# EAGLE schematic Antenna Board v2 (EAGLE 9.6.2)
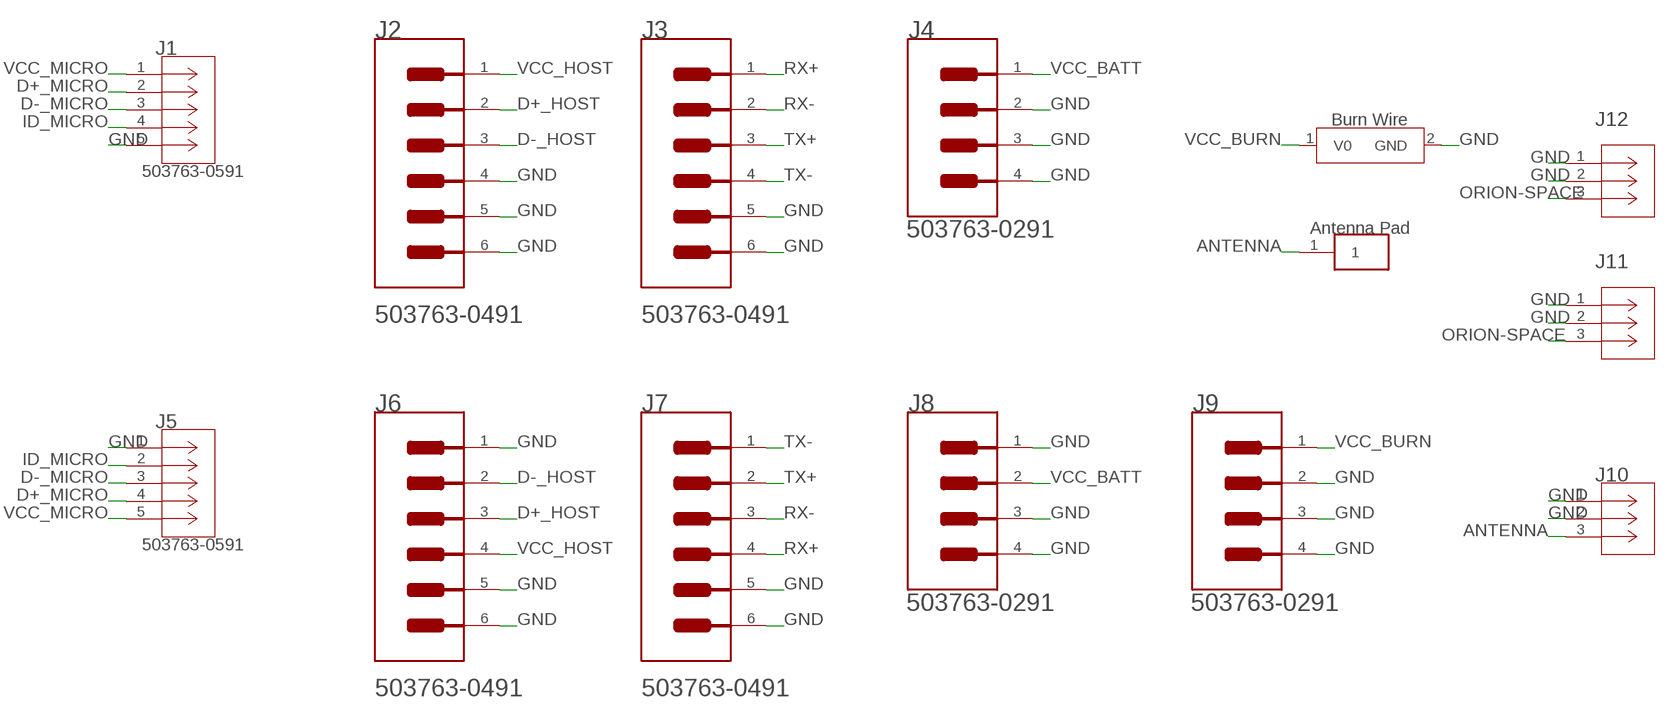
[diagram p0: schematic, sheet 1]

## Parts
J1  503763-0591  [CONN_5037630591_MOL]
J2  MOLEX_503763-0491MOLEX_503763-0491_0_0  [MOLEX_503763-0491_0]
J3  MOLEX_503763-0491MOLEX_503763-0491_0_0  [MOLEX_503763-0491_0]
J4  MOLEX_503763-0291MOLEX_503763-0291_0_0  [MOLEX_503763-0291_0]
J5  503763-0591  [CONN_5037630591_MOL]
J6  MOLEX_503763-0491MOLEX_503763-0491_0_0  [MOLEX_503763-0491_0]
J7  MOLEX_503763-0491MOLEX_503763-0491_0_0  [MOLEX_503763-0491_0]
J8  MOLEX_503763-0291MOLEX_503763-0291_0_0  [MOLEX_503763-0291_0]
J9  MOLEX_503763-0291MOLEX_503763-0291_0_0  [MOLEX_503763-0291_0]
J10  U.FL-R-SMT-1(01)  [CONN_-SMT-1(01)]
J11  U.FL-R-SMT-1(01)  [CONN_-SMT-1(01)]
J12  U.FL-R-SMT-1(01)  [CONN_-SMT-1(01)]
U$2  ANTENNA_PAD  [ANTENNA_PAD]
U$3  BURNWIRE  [BURNWIRE]

## Nets
ANTENNA: J10.3 U$2.1
D+_HOST: J2.2 J6.3
D+_MICRO: J1.2 J5.4
D-_HOST: J2.3 J6.2
D-_MICRO: J1.3 J5.3
GND: J1.5 J2.4 J2.5(MNT_1) J2.6(MNT_2) J3.5(MNT_1) J3.6(MNT_2) J4.2 J4.3(MNT_1) J4.4(MNT_2) J5.1 J6.1 J6.5(MNT_1) J6.6(MNT_2) J7.5(MNT_1) J7.6(MNT_2) J8.1 J8.3(MNT_1) J8.4(MNT_2) J9.2 J9.3(MNT_1) J9.4(MNT_2) J10.1 J10.2 J11.1 J11.2 J12.1 J12.2 U$3.2(GND)
ID_MICRO: J1.4 J5.2
ORION-SPACE: J11.3 J12.3
RX+: J3.1 J7.4
RX-: J3.2 J7.3
TX+: J3.3 J7.2
TX-: J3.4 J7.1
VCC_BATT: J4.1 J8.2
VCC_BURN: J9.1 U$3.1(V0)
VCC_HOST: J2.1 J6.4
VCC_MICRO: J1.1 J5.5

## Library data of the parts
J1 J5 = Molex - 503763-0591:503763-0591; BUILT_BY: EMA_Cory; COPYRIGHT: Copyright (C) 2018 Accelerated Designs. All rights reserved; DATASHEET: https://www.molex.com/pdm_docs/sd/5037630591_sd.pdf; MANUFACTURER_PART_NUMBER: 503763-0591; SOURCELIBRARY: Add_to_database_2020-12-14; VENDOR: Molex Connector Corporation
J2 J3 J6 J7 = Molex - 503763-0491:MOLEX_503763-0491: Wire-To-Board Connector, Pico-Lock 503763 Series, Surface Mount, Header, 4 Contacts, 1 mm; AUTOMOTIVE: No; CENTROID_NOT_SPECIFIED: No; CONN_GENDER: Male; CONN_ORIENTATION: Right Angle; CONTACT_MATERIAL: Gold,Nickel; CURRENT_RATING: 1.5A; DATASHEET: https://www.molex.com/webdocs/datasheets/pdf/en-us/5037630491_PCB_HEADERS.pdf; DEVICE_CLASS_L1: Connectors; DEVICE_CLASS_L2: Headers and Wire Housings; DEVICE_CLASS_L3: unset; DIGIKEY_DESCRIPTION: CONN HEADER 1MM R/A 4CKT; DIGIKEY_PART_NUMBER: WM10655CT-ND; FOOTPRINT_URL: https://www.molex.com/pdm_docs/sd/5037630491_sd.pdf; FOOTPRINT_VARIANT_NAME_0: Recommended_Land_Pattern; HEIGHT: 1.7mm; LEAD_FREE: Yes; MF: Molex; MFG_PACKAGE_IDENT: 503763-0491; MFG_PACKAGE_IDENT_DATE: 0; MFG_PACKAGE_IDENT_REV: 0; MOUSER_PART_NUMBER: 538-503763-0491; MPN: 503763-0491; NUMBER_OF_CONTACTS: 4; NUMBER_OF_ROWS: 1; PACKAGE: HDR4; PITCH: 1mm; PREFIX: J; ROHS: Yes; TEMPERATURE_RANGE_HIGH: +105°C; TEMPERATURE_RANGE_LOW: -40°C; VERIFICATION_VERSION: 0.0.0.1; VOLTAGE_RATING: 150V
J4 J8 J9 = Molex - 503763-0291:MOLEX_503763-0291: 2 Positions Header Connector 0.039" (1.00mm) Surface Mount, Right Angle Gold; CENTROID_NOT_SPECIFIED: No; DATASHEET: http://www.molex.com/pdm_docs/sd/5037630291_sd.pdf; DIGIKEY_DESCRIPTION: CONN HEADER 1MM R/A 2CKT; DIGIKEY_PART_NUMBER: WM10654CT-ND; LEAD_FREE: yes; MF: Molex; MOUSER_PART_NUMBER: 538-503763-0291; MPN: 503763-0291; PACKAGE: HDR02; PREFIX: J; ROHS: yes; TEMPERATURE_RANGE_HIGH: +105°C; TEMPERATURE_RANGE_LOW: -40°C
J10 = U.FL-R-SMT-1(01):U.FL-R-SMT-1(01); BUILT_BY: EMA_Matt; COPYRIGHT: Copyright (C) 2018 Accelerated Designs. All rights reserved; MANUFACTURER_PART_NUMBER: U.FL-R-SMT-1(01); SOURCELIBRARY: Hirose_12_20_2019; VENDOR: Hirose
J11 J12 = U.FL-R-SMT:U.FL-R-SMT-1(01); BUILT_BY: EMA_Matt; COPYRIGHT: Copyright (C) 2018 Accelerated Designs. All rights reserved; MANUFACTURER_PART_NUMBER: U.FL-R-SMT-1(01); SOURCELIBRARY: Hirose_12_20_2019; VENDOR: Hirose
U$2 = Antenna_Pad:ANTENNA_PAD
U$3 = Burn_Wire:BURNWIRE